# EAGLE design slave (EAGLE 6.5.0)
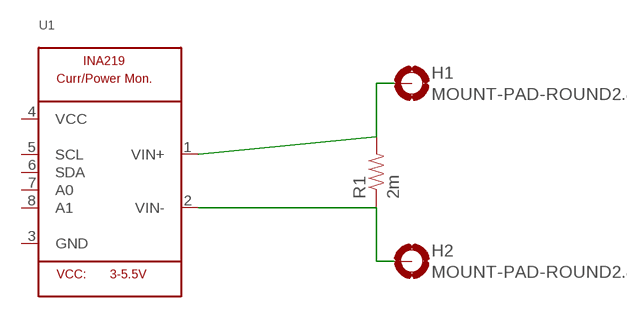
[diagram p0: schematic, sheet 1]

## Parts
H1  MOUNT-PAD-ROUND2.8  [2,8-PAD]
H2  MOUNT-PAD-ROUND2.8  [2,8-PAD]
R1  2m  RESISTOR2512  [R2512]
U1  INA219  [SOT23-8]

## Nets
N$1: H1.B2,8(MOUNT) R1.2 U1.1(VIN+)
N$2: H2.B2,8(MOUNT) R1.1 U1.2(VIN-)
Unconnected: U1.3(GND) U1.4(VCC) U1.5(SCL) U1.6(SDA) U1.7(A0) U1.8(A1)

## Library data of the parts
H1 H2 = holes:MOUNT-PAD-ROUND: MOUNTING PAD, round
R1 = SparkFun-Passives:RESISTOR: Resistor Basic schematic elements and footprints for 0603, 1206, and PTH resistors.
U1 = microbuilder:INA219: INA219 - I2C Current/Power Monitor Voltage Range: 0-26V Accuracy: 0.5% Temperature: -40°C - 125°C

## Board
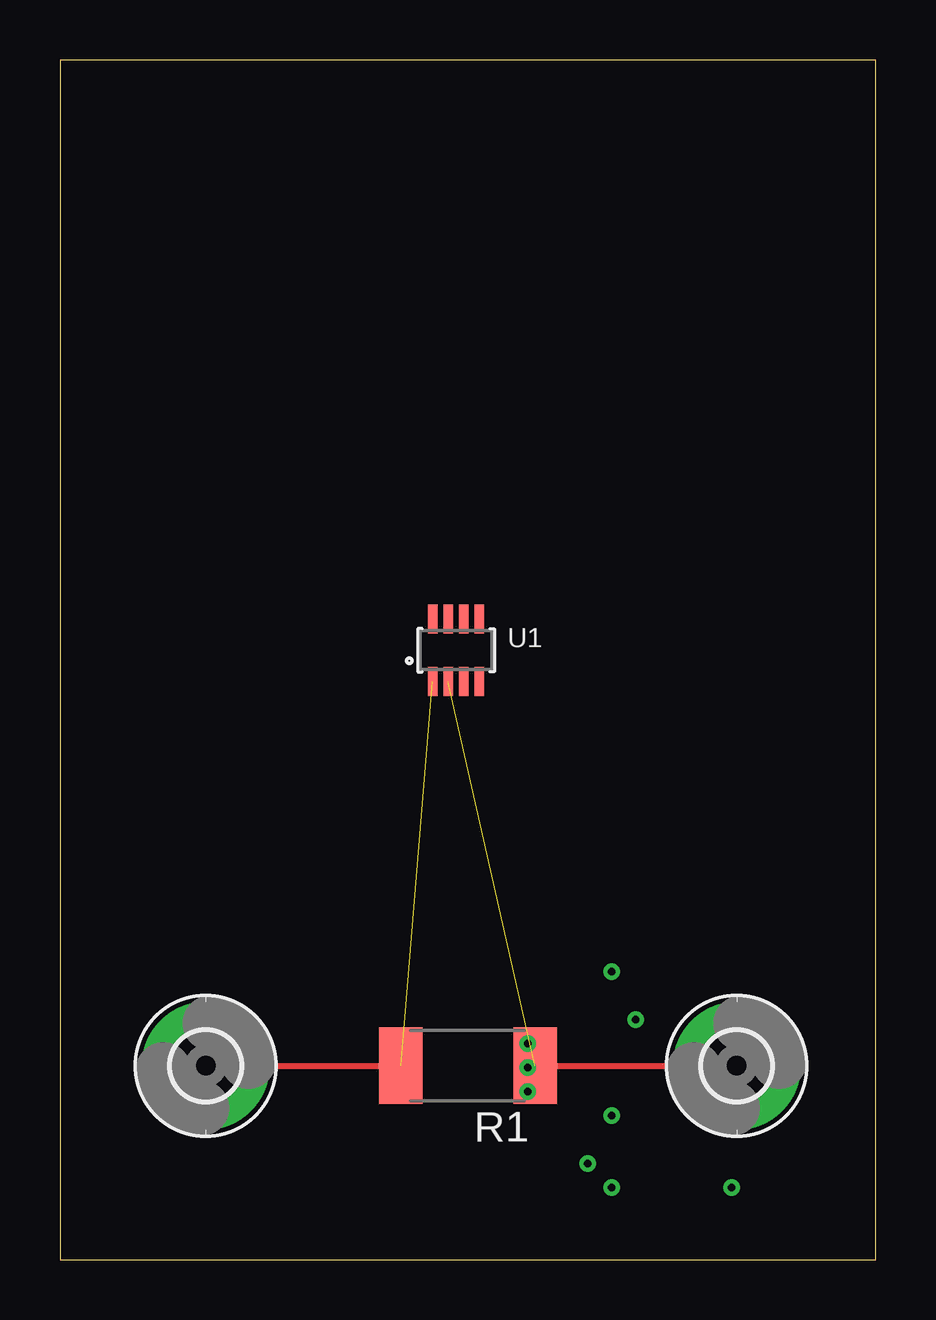
[diagram p1: board, top side]

Size 34 x 50 mm. Coordinates in mm from the lower left corner, seen from the top.
Outline: 0,0 34,0 34,50 0,50 0,0
Copper layers (1*16): Top 0.035mm / dielectric 1.5mm / Bottom 0.035mm
Design rules "default": minimum track width 10mil, minimum drill 24mil, track to track 8mil, track to pad 8mil, pad to pad 8mil, via to via 8mil, smd to smd 8mil, copper to edge 40mil, drill to drill 8mil, minimum pad ring 10mil, minimum via ring 8mil, stop-mask expansion 4mil, vias tented up to drill 0mil, thermal gap 10mil

### Footprints (pad centres in the part's own frame; a part is rotated, then mirrored left to right if it is on the bottom)
2,8-PAD = drill 2.8 pad 5.334: B2,8 0,0
R2512 = smd 1.8 x 3.2: 1 -2.8,0; 2 2.8,0
SOT23-8 = smd 0.4 x 1.2: 1 -0.975,-1.3; 2 -0.325,-1.3; 3 0.325,-1.3; 4 0.975,-1.3; 5 0.975,1.3; 6 0.325,1.3; 7 -0.325,1.3; 8 -0.975,1.3

### Placement (x,y rotation side)
H1  6.08,8.08 0 top
H2  28.21,8.08 0 top
R1  17.01,8.08 180 top
U1  16.51,25.4 0 top

### Tracks (layer width: path | path; a pad name or v marks a point on that pad's centre or on a via)
N$1  (1 unrouted)
  Top 0.254: H1.B2,8 R1.2
N$2  (1 unrouted)
  Top 0.254: R1.1 H2.B2,8
N$3  (via drill 0.3)
  other vias: 19.5,9
N$4  (via drill 0.3)
  other vias: 19.5,8
N$5  (via drill 0.3)
  other vias: 19.5,7
N$6  (via drill 0.3)
  other vias: 23,12
N$7  (via drill 0.3)
  other vias: 24,10
N$8  (via drill 0.3)
  other vias: 23,6
N$9  (via drill 0.3)
  other vias: 28,3
N$10  (via drill 0.3)
  other vias: 23,3
N$11  (via drill 0.3)
  other vias: 22,4